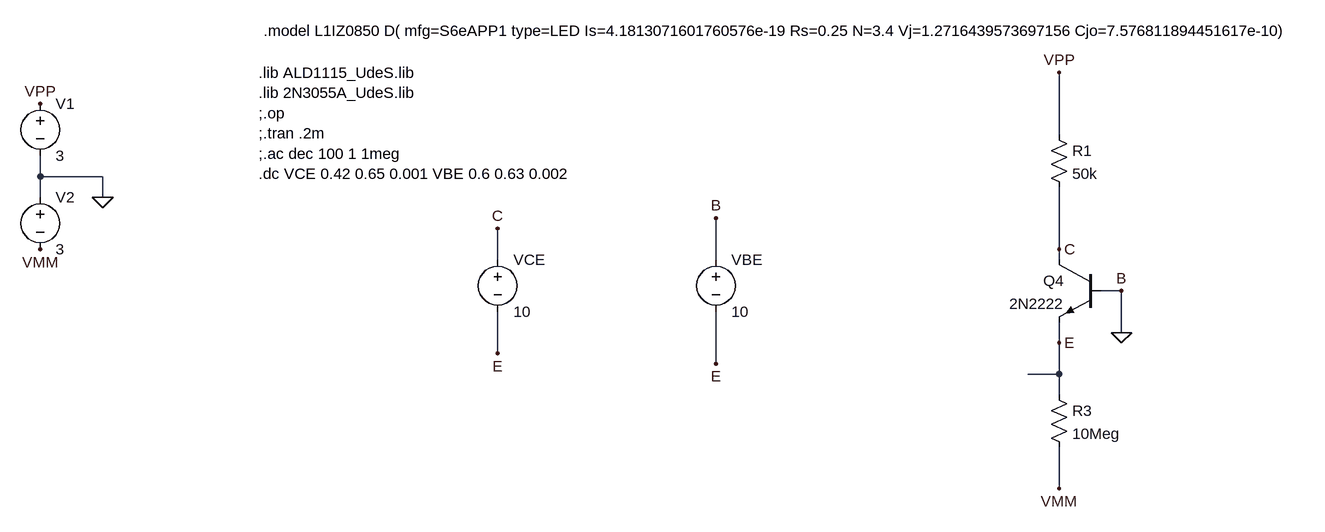
[diagram p0: schematic e1.asc]
e1.asc, the LTspice schematic file:
Version 4
SHEET 1 2260 1604
WIRE 592 0 592 -96
WIRE -976 64 -976 32
WIRE -880 64 -976 64
WIRE -976 96 -976 64
WIRE -880 96 -880 64
WIRE 592 176 592 80
WIRE -272 192 -272 144
WIRE 64 192 64 128
WIRE 592 192 592 176
WIRE 688 240 656 240
WIRE 688 304 688 240
WIRE 592 320 592 288
WIRE -272 336 -272 272
WIRE 64 352 64 272
WIRE 592 368 592 320
WIRE 592 368 544 368
WIRE 592 400 592 368
WIRE 592 544 592 480
FLAG -976 -48 VPP
FLAG -976 176 VMM
FLAG -880 96 0
FLAG 592 -96 VPP
FLAG 592 544 VMM
FLAG 592 320 E
FLAG 688 240 B
FLAG -272 144 C
FLAG -272 336 E
FLAG 592 176 C
FLAG 64 128 B
FLAG 64 352 E
FLAG 688 304 0
SYMBOL /voltage -976 -64 R0
WINDOW 123 0 0 Left 0
WINDOW 39 0 0 Left 0
SYMATTR InstName V1
SYMATTR Value 3
SYMBOL /voltage -976 80 R0
WINDOW 123 0 0 Left 0
WINDOW 39 0 0 Left 0
SYMATTR InstName V2
SYMATTR Value 3
SYMBOL /npn 656 192 M0
SYMATTR InstName Q4
SYMATTR Value 2N2222
SYMBOL /res 576 -16 R0
SYMATTR InstName R1
SYMATTR Value 50k
SYMBOL /res 576 384 R0
SYMATTR InstName R3
SYMATTR Value 10Meg
SYMBOL /voltage -272 176 R0
SYMATTR InstName VCE
SYMATTR Value 10
SYMBOL /voltage 64 176 R0
SYMATTR InstName VBE
SYMATTR Value 10
TEXT -640 -96 Left 2 !.lib ALD1115_UdeS.lib\n.lib 2N3055A_UdeS.lib\n;.op\n;.tran .2m\n;.ac dec 100 1 1meg\n.dc VCE 0.42 0.65 0.001 VBE 0.6 0.63 0.002
TEXT -632 -160 Left 2 !.model L1IZ0850 D( mfg=S6eAPP1 type=LED Is=4.1813071601760576e-19 Rs=0.25 N=3.4 Vj=1.2716439573697156 Cjo=7.576811894451617e-10)

The netlist it stands for:
* e1.asc
V1 VPP 0 3
V2 0 VMM 3
Q4 C 0 E 0 2N2222
R1 VPP C 50k
R3 E VMM 10Meg
VCE C E 10
VBE 0 E 10
.model NPN NPN
.model PNP PNP
.lib standard.bjt
.lib ALD1115_UdeS.lib
.lib 2N3055A_UdeS.lib
;.op
;.tran .2m
;.ac dec 100 1 1meg
.dc VCE 0.42 0.65 0.001 VBE 0.6 0.63 0.002
.model L1IZ0850 D( mfg=S6eAPP1 type=LED Is=4.1813071601760576e-19 Rs=0.25 N=3.4 Vj=1.2716439573697156 Cjo=7.576811894451617e-10)
.backanno
.end

* Results of the author's LTspice run, read from the files saved beside the schematic
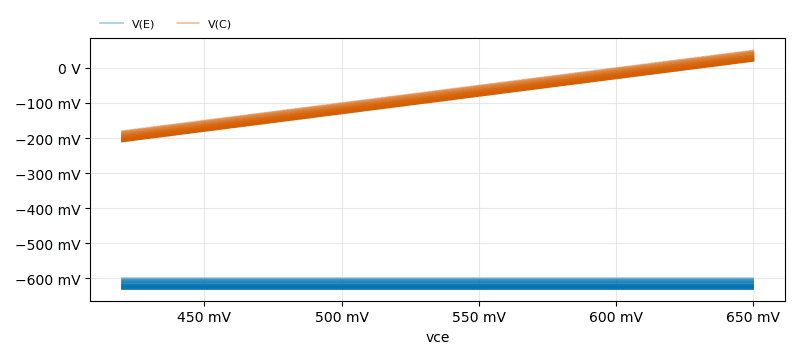
[diagram p1: DC transfer characteristic of e1.asc, plotted from the saved traces]
* DC transfer characteristic, 16 runs:
*   V(E) [vbe=0.6]: -600 mV at vce=420 mV, -600 mV at vce=650 mV, min -600 mV, max -600 mV
*   V(E) [vbe=0.602]: -602 mV at vce=420 mV, -602 mV at vce=650 mV, min -602 mV, max -602 mV
*   V(E) [vbe=0.604]: -604 mV at vce=420 mV, -604 mV at vce=650 mV, min -604 mV, max -604 mV
*   V(E) [vbe=0.606]: -606 mV at vce=420 mV, -606 mV at vce=650 mV, min -606 mV, max -606 mV
*   V(E) [vbe=0.608]: -608 mV at vce=420 mV, -608 mV at vce=650 mV, min -608 mV, max -608 mV
*   V(E) [vbe=0.61]: -610 mV at vce=420 mV, -610 mV at vce=650 mV, min -610 mV, max -610 mV
*   V(E) [vbe=0.612]: -612 mV at vce=420 mV, -612 mV at vce=650 mV, min -612 mV, max -612 mV
*   V(E) [vbe=0.614]: -614 mV at vce=420 mV, -614 mV at vce=650 mV, min -614 mV, max -614 mV
*   V(C) [vbe=0.6]: -180 mV at vce=420 mV, 50 mV at vce=650 mV, min -180 mV, max 50 mV
*   V(C) [vbe=0.602]: -182 mV at vce=420 mV, 48 mV at vce=650 mV, min -182 mV, max 48 mV
*   V(C) [vbe=0.604]: -184 mV at vce=420 mV, 46 mV at vce=650 mV, min -184 mV, max 46 mV
*   V(C) [vbe=0.606]: -186 mV at vce=420 mV, 44 mV at vce=650 mV, min -186 mV, max 44 mV
*   V(C) [vbe=0.608]: -188 mV at vce=420 mV, 42 mV at vce=650 mV, min -188 mV, max 42 mV
*   V(C) [vbe=0.61]: -190 mV at vce=420 mV, 40 mV at vce=650 mV, min -190 mV, max 40 mV
*   V(C) [vbe=0.612]: -192 mV at vce=420 mV, 38 mV at vce=650 mV, min -192 mV, max 38 mV
*   V(C) [vbe=0.614]: -194 mV at vce=420 mV, 36 mV at vce=650 mV, min -194 mV, max 36 mV